# EAGLE design power_supply (EAGLE 9.6.2)
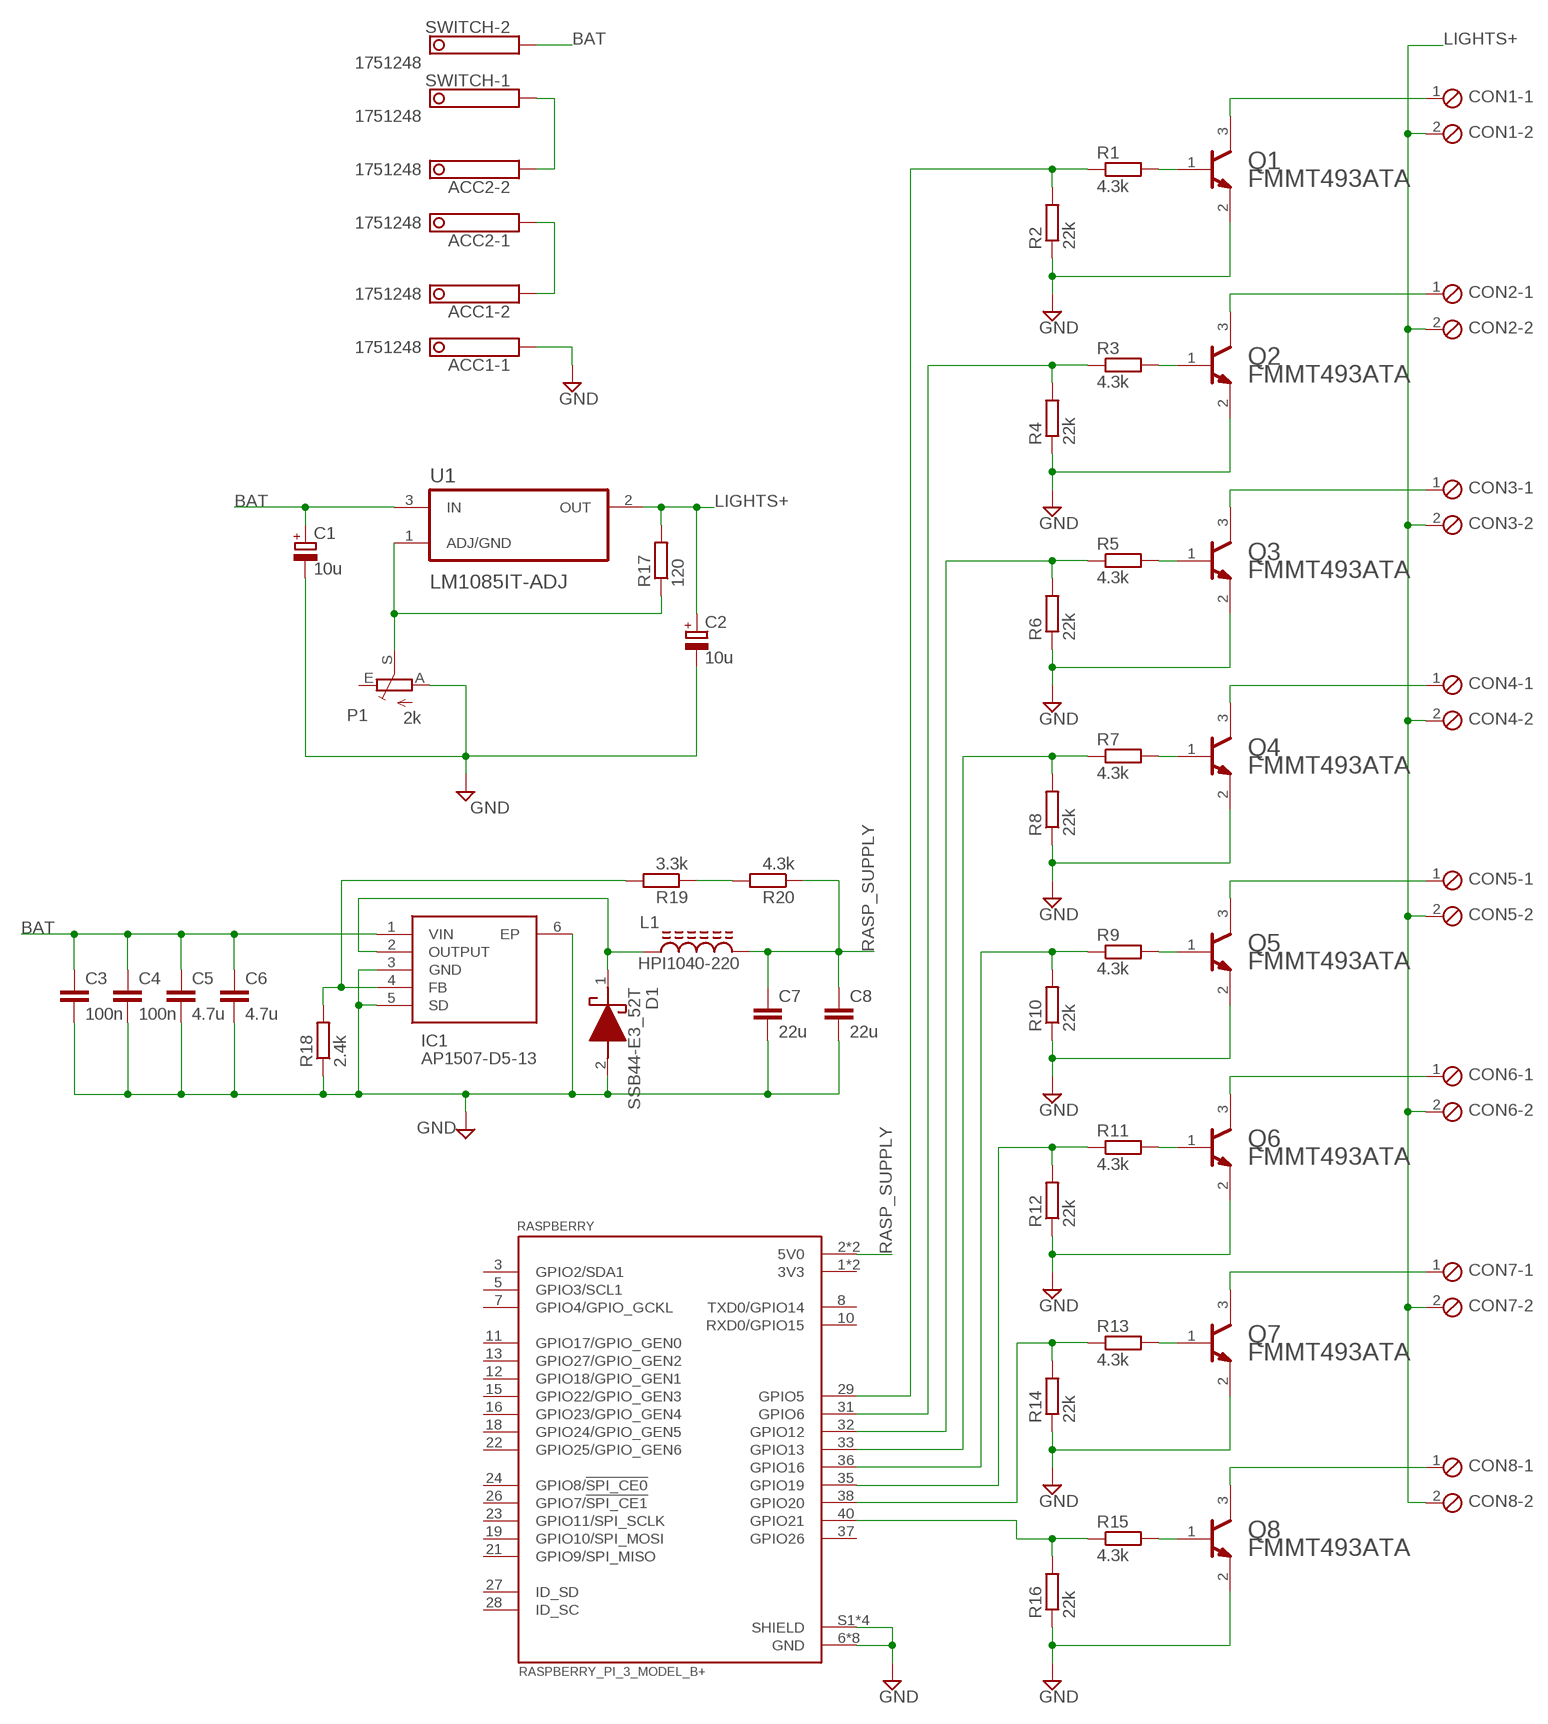
[diagram p0: schematic, sheet 1]

## Parts
ACC1  1751248  [1751248]
ACC2  1751248  [1751248]
C1  10u  CPOL-EUB/3528-21R  [B/3528-21R]
C2  10u  CPOL-EUB/3528-21R  [B/3528-21R]
C3  100n  C-EUC0603  [C0603]
C4  100n  C-EUC0603  [C0603]
C5  4.7u  C-EUC1206  [C1206]
C6  4.7u  C-EUC1206  [C1206]
C7  22u  C-EUC1206  [C1206]
C8  22u  C-EUC1206  [C1206]
CON1  +  MPT2  [2POL254]
CON2  +  MPT2  [2POL254]
CON3  +  MPT2  [2POL254]
CON4  +  MPT2  [2POL254]
CON5  +  MPT2  [2POL254]
CON6  +  MPT2  [2POL254]
CON7  +  MPT2  [2POL254]
CON8  +  MPT2  [2POL254]
D1  SSB44-E3_52T  [DIOM5436X244N]
IC1  AP1507-D5-13  [AP1507D513]
L1  HPI1040-220  SRR1050A-151Y  [INDM102100X510N]
P1  2k  TRIM_EU-CA6V  [CA6V]
Q1  DIODES_FMMT493ATADIODES_FMMT493ATA_0_0  [DIODES_FMMT493ATA_0]
Q2  DIODES_FMMT493ATADIODES_FMMT493ATA_0_0  [DIODES_FMMT493ATA_0]
Q3  DIODES_FMMT493ATADIODES_FMMT493ATA_0_0  [DIODES_FMMT493ATA_0]
Q4  DIODES_FMMT493ATADIODES_FMMT493ATA_0_0  [DIODES_FMMT493ATA_0]
Q5  DIODES_FMMT493ATADIODES_FMMT493ATA_0_0  [DIODES_FMMT493ATA_0]
Q6  DIODES_FMMT493ATADIODES_FMMT493ATA_0_0  [DIODES_FMMT493ATA_0]
Q7  DIODES_FMMT493ATADIODES_FMMT493ATA_0_0  [DIODES_FMMT493ATA_0]
Q8  DIODES_FMMT493ATADIODES_FMMT493ATA_0_0  [DIODES_FMMT493ATA_0]
R1  4.3k  R-EU_R0805  [R0805]
R2  22k  R-EU_R0805  [R0805]
R3  4.3k  R-EU_R0805  [R0805]
R4  22k  R-EU_R0805  [R0805]
R5  4.3k  R-EU_R0805  [R0805]
R6  22k  R-EU_R0805  [R0805]
R7  4.3k  R-EU_R0805  [R0805]
R8  22k  R-EU_R0805  [R0805]
R9  4.3k  R-EU_R0805  [R0805]
R10  22k  R-EU_R0805  [R0805]
R11  4.3k  R-EU_R0805  [R0805]
R12  22k  R-EU_R0805  [R0805]
R13  4.3k  R-EU_R0805  [R0805]
R14  22k  R-EU_R0805  [R0805]
R15  4.3k  R-EU_R0805  [R0805]
R16  22k  R-EU_R0805  [R0805]
R17  120  R-EU_R0805  [R0805]
R18  2.4k  R-EU_R0805  [R0805]
R19  3.3k  R-EU_R0805  [R0805]
R20  4.3k  R-EU_R0805  [R0805]
RASPBERRY  RASPBERRY_PI_3_MODEL_B+  [MODULE_RASPBERRY_PI_3_MODEL_B+]
SWITCH  1751248  [1751248]
U1  LM1085IT-ADJ  [TO254P1054X470X1955-3]

## Nets
BAT: C1.+ C3.1 C4.1 C5.1 C6.1 IC1.1(VIN) SWITCH.2 U1.3(IN)
GND: ACC1.1 C1.- C2.- C3.2 C4.2 C5.2 C6.2 C7.2 C8.2 D1.2(A) IC1.3(GND) IC1.5(SD) IC1.6(EP) P1.A Q1.2(E) Q2.2(E) Q3.2(E) Q4.2(E) Q5.2(E) Q6.2(E) Q7.2(E) Q8.2(E) R2.1 R4.1 R6.1 R8.1 R10.1 R12.1 R14.1 R16.1 R18.1 RASPBERRY.6(GND) RASPBERRY.9(GND) RASPBERRY.14(GND) RASPBERRY.20(GND) RASPBERRY.25(GND) RASPBERRY.30(GND) RASPBERRY.34(GND) RASPBERRY.39(GND) RASPBERRY.S1(SHIELD) RASPBERRY.S2(SHIELD) RASPBERRY.S3(SHIELD) RASPBERRY.S4(SHIELD)
LIGHTS+: C2.+ CON1.2 CON2.2 CON3.2 CON4.2 CON5.2 CON6.2 CON7.2 CON8.2 R17.2 U1.2(OUT)
N$1: CON1.1 Q1.3(C)
N$2: R19.1 R20.2
N$3: ACC1.2 ACC2.1
N$4: IC1.4(FB) R18.2 R19.2
N$5: Q2.1(B) R3.2
N$6: CON2.1 Q2.3(C)
N$7: ACC2.2 SWITCH.1
N$9: Q3.1(B) R5.2
N$10: CON3.1 Q3.3(C)
N$13: Q4.1(B) R7.2
N$14: CON4.1 Q4.3(C)
N$17: Q5.1(B) R9.2
N$18: CON5.1 Q5.3(C)
N$19: R1.1 R2.2 RASPBERRY.29(GPIO5)
N$20: R3.1 R4.2 RASPBERRY.31(GPIO6)
N$21: R5.1 R6.2 RASPBERRY.32(GPIO12)
N$22: Q1.1(B) R1.2
N$23: R7.1 R8.2 RASPBERRY.33(GPIO13)
N$24: R9.1 R10.2 RASPBERRY.36(GPIO16)
N$25: R11.1 R12.2 RASPBERRY.35(GPIO19)
N$26: R13.1 R14.2 RASPBERRY.38(GPIO20)
N$27: R15.1 R16.2 RASPBERRY.40(GPIO21)
N$29: P1.S R17.1 U1.1(ADJ/GND)
N$32: D1.1(K) IC1.2(OUTPUT) L1.1
N$33: Q6.1(B) R11.2
N$34: CON6.1 Q6.3(C)
N$37: Q7.1(B) R13.2
N$38: CON7.1 Q7.3(C)
N$41: Q8.1(B) R15.2
N$42: CON8.1 Q8.3(C)
RASP_SUPPLY: C7.1 C8.1 L1.2 R20.1 RASPBERRY.2(5V0) RASPBERRY.4(5V0)
Unconnected: P1.E RASPBERRY.3(GPIO2/SDA1) RASPBERRY.5(GPIO3/SCL1) RASPBERRY.7(GPIO4/GPIO_GCKL) RASPBERRY.8(TXD0/GPIO14) RASPBERRY.10(RXD0/GPIO15) RASPBERRY.11(GPIO17/GPIO_GEN0) RASPBERRY.12(GPIO18/GPIO_GEN1) RASPBERRY.13(GPIO27/GPIO_GEN2) RASPBERRY.15(GPIO22/GPIO_GEN3) RASPBERRY.16(GPIO23/GPIO_GEN4) RASPBERRY.18(GPIO24/GPIO_GEN5) RASPBERRY.19(GPIO10/SPI_MOSI) RASPBERRY.21(GPIO9/SPI_MISO) RASPBERRY.22(GPIO25/GPIO_GEN6) RASPBERRY.23(GPIO11/SPI_SCLK) RASPBERRY.24(GPIO8/!SPI_CE0!) RASPBERRY.26(GPIO7/!SPI_CE1!) RASPBERRY.27(ID_SD) RASPBERRY.28(ID_SC) RASPBERRY.37(GPIO26)

## Power pins joined to a net without a drawn wire
3V3: RASPBERRY.1(3V3) RASPBERRY.17(3V3)

## Library data of the parts
ACC1 ACC2 SWITCH = con-phoenix-350:1751248: MKDS 1/ 2-3,5 Printklemme Nennstrom: 10 A Bemessungsspannung: 160 V Raster: 3,5 mm Polzahl: 2 Montageart: Löten Anschlussart: Schraubanschluss Anschlussrichtung vom Leiter zur Platine: 0° Source: http://eshop.phoenixcontact.com .. 1751248.pdf; OC_FARNELL: unknown; OC_NEWARK: unknown
C1 C2 = rcl:CPOL-EU: POLARIZED CAPACITOR, European symbol; SPICEPREFIX: C
C3-C8 = rcl:C-EU: CAPACITOR, European symbol; SPICEPREFIX: C
CON1-CON8 = con-phoenix-254:MPT2: PHOENIX CONNECTOR; OC_FARNELL: unknown; OC_NEWARK: unknown
D1 = SSB44-E3_52T:SSB44-E3_52T: Vishay 40V 4A, Schottky Diode, 2-Pin DO-214AA SSB44-E3/52T Source: Datasheet <https://www.vishay.com/docs/88884/ssb43l.pdf>; ARROW_PART_NUMBER: SSB44-E3/52T; ARROW_PRICE-STOCK: https://www.arrow.com/en/products/ssb44-e352t/vishay?region=europe; DESCRIPTION: Vishay 40V 4A, Schottky Diode, 2-Pin DO-214AA SSB44-E3/52T; HEIGHT: 2.44mm; MANUFACTURER_NAME: Vishay; MANUFACTURER_PART_NUMBER: SSB44-E3/52T; MOUSER_PART_NUMBER: 625-SSB44-E3; MOUSER_PRICE-STOCK: https://www.mouser.co.uk/ProductDetail/Vishay-General-Semiconductor/SSB44-E3-52T?qs=x2jpVgRnAtOp%252BgpElPB95w%3D%3D
IC1 = AP1507-D5-13:AP1507-D5-13: Switching Voltage Regulators DCDC Conv HV Buck Source: Datasheet <https://componentsearchengine.com/Datasheets/1/AP1507-D5-13.pdf>; DESCRIPTION: Switching Voltage Regulators DCDC Conv HV Buck; HEIGHT: 2mm; MANUFACTURER_NAME: Diodes Inc.; MANUFACTURER_PART_NUMBER: AP1507-D5-13; MOUSER_PART_NUMBER: 621-AP1507-D5-13; MOUSER_PRICE-STOCK: https://www.mouser.com/Search/Refine.aspx?Keyword=621-AP1507-D5-13
L1 = SRR1050A-151Y:SRR1050A-151Y: Inductor Power Shielded Wirewound 12uH 30% 100KHz Ferrite 3.8A 35mOhm DCR Automotive T/R Check availability <https://pricing.snapeda.com/parts/SRR1050A-151Y/Bourns/view-part?ref=eda>; AVAILABILITY: In Stock; DESCRIPTION: Inductor Power Shielded Wirewound 150uH 30% 100KHz Ferrite 1.1A 370mOhm DCR Automotive T/R; MF: Bourns; MP: SRR1050A-151Y; PACKAGE: Nonstandard Bourns; PRICE: None; PURCHASE-URL: https://pricing.snapeda.com/search/part/SRR1050A-151Y/?ref=eda
P1 = pot:TRIM_EU-: POTENTIOMETER
Q1-Q8 = Diodes - FMMT493ATA:DIODES_FMMT493ATA: TRANS NPN 60V 1A SOT23-3; CENTROID_NOT_SPECIFIED: No; COLLECTOR_BASE_VOLTAGE: 120V; COLLECTOR_EMITTER_BREAKDOWN_VOLTAGE: 60V; COLLECTOR_EMITTER_SATURATION_VOLTAGE: 500mV; COLLECTOR_EMITTER_VOLTAGE: 60V; DATASHEET: https://www.diodes.com/assets/Datasheets/FMMT493A.pdf; DEVICE_CLASS_L1: Discrete Semiconductors; DEVICE_CLASS_L2: Transistors; DEVICE_CLASS_L3: BJTs; DIGIKEY_DESCRIPTION: TRANS NPN 60V 1A SOT23-3; DIGIKEY_PART_NUMBER: FMMT493ACT-ND; EMITTER_BASE_VOLTAGE: 7V; FOOTPRINT_URL: https://www.diodes.com/assets/Package-Files/SOT23-Type-DN.pdf; HEIGHT: 1.12mm; HFE_MIN: 20; LEAD_FREE: yes; MAX_COLLECTOR_CURRENT: 1A; MAX_JUNCTION_TEMP: +150°C; MF: Diodes; MFG_PACKAGE_IDENT: SOT23 (Type DN); MFG_PACKAGE_IDENT_DATE: 12/2016; MFG_PACKAGE_IDENT_REV: 0; MOUSER_DESCRIPTION: Bipolar Transistors - BJT NPN Medium Power; MOUSER_PART_NUMBER: 522-FMMT493ATA; MPN: FMMT493ATA; NUMBER_OF_ELEMENTS: 1; NUMBER_OF_NPN: 1; PACKAGE: SOT23 (Type DN); POWER_DISSIPATION: 500mW; PREFIX: Q; ROHS: yes; STANDOFF_HEIGHT: 0.01mm; TEMPERATURE_RANGE_HIGH: +150°C; TEMPERATURE_RANGE_LOW: -55°C; VERIFICATION_VERSION: 0.0.0.1
R1-R20 = rcl:R-EU_: RESISTOR, European symbol; SPICEPREFIX: R
RASPBERRY = RASPBERRY_PI_3_MODEL_B_NoScrew:RASPBERRY_PI_3_MODEL_B+: BCM2835 Raspberry Pi Model B+ - ARM11, VideoCore MPU Embedded Evaluation Board Check availability <https://pricing.snapeda.com/parts/RASPBERRY%20PI%203%20MODEL%20B%2B/Raspberry%20Pi/view-part?ref=eda>; AVAILABILITY: In Stock; DESCRIPTION: RASPBERRY PI 3 MOD B+ BCM2837B0; MF: Raspberry Pi; MP: RASPBERRY PI 3 MODEL B+; PACKAGE: None; PRICE: None; PURCHASE-URL: https://pricing.snapeda.com/search/part/RASPBERRY PI 3 MODEL B+/?ref=eda
U1 = LM1085IT-ADJ:LM1085IT-ADJ: Check availability <https://pricing.snapeda.com/parts/LM1085IT-ADJ/NOPB/Texas%20Instruments/view-part?ref=eda>; AVAILABILITY: In Stock; DESCRIPTION: 3-A, 29-V, linear voltage regulator; MF: Texas Instruments; MP: LM1085IT-ADJ/NOPB; PACKAGE: TO-220-3 Texas Instruments; PRICE: None; PURCHASE-URL: https://pricing.snapeda.com/search/part/LM1085IT-ADJ/NOPB/?ref=eda

## Board
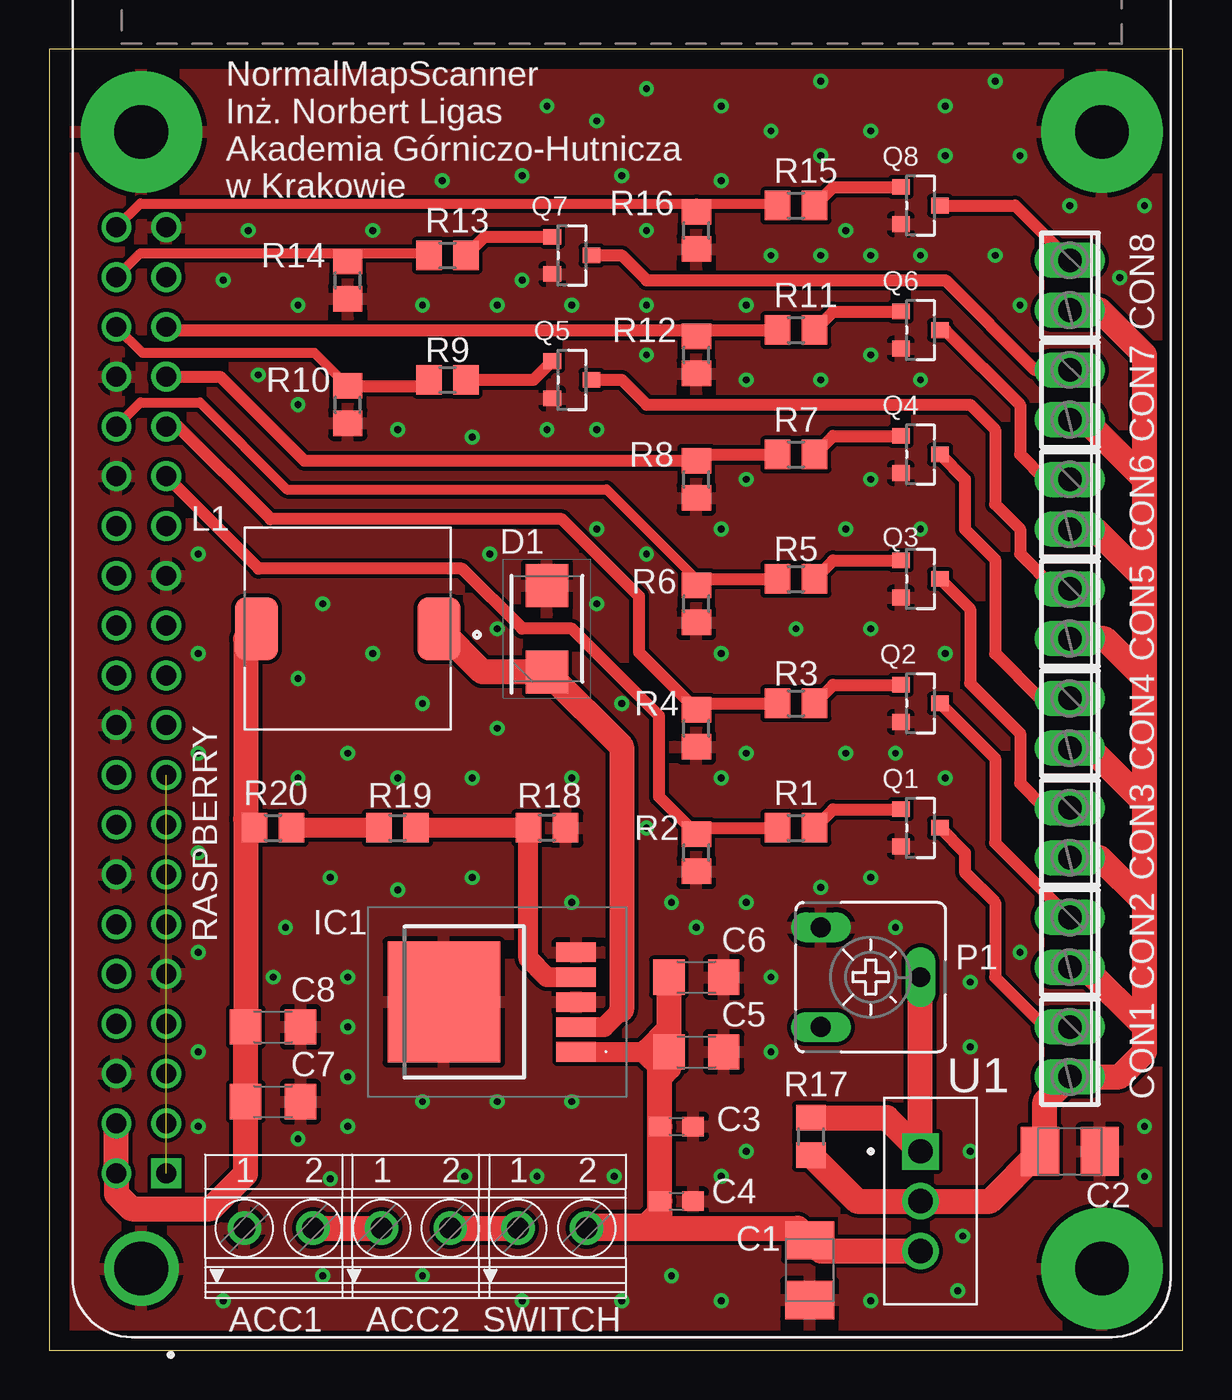
[diagram p1: board, top side]
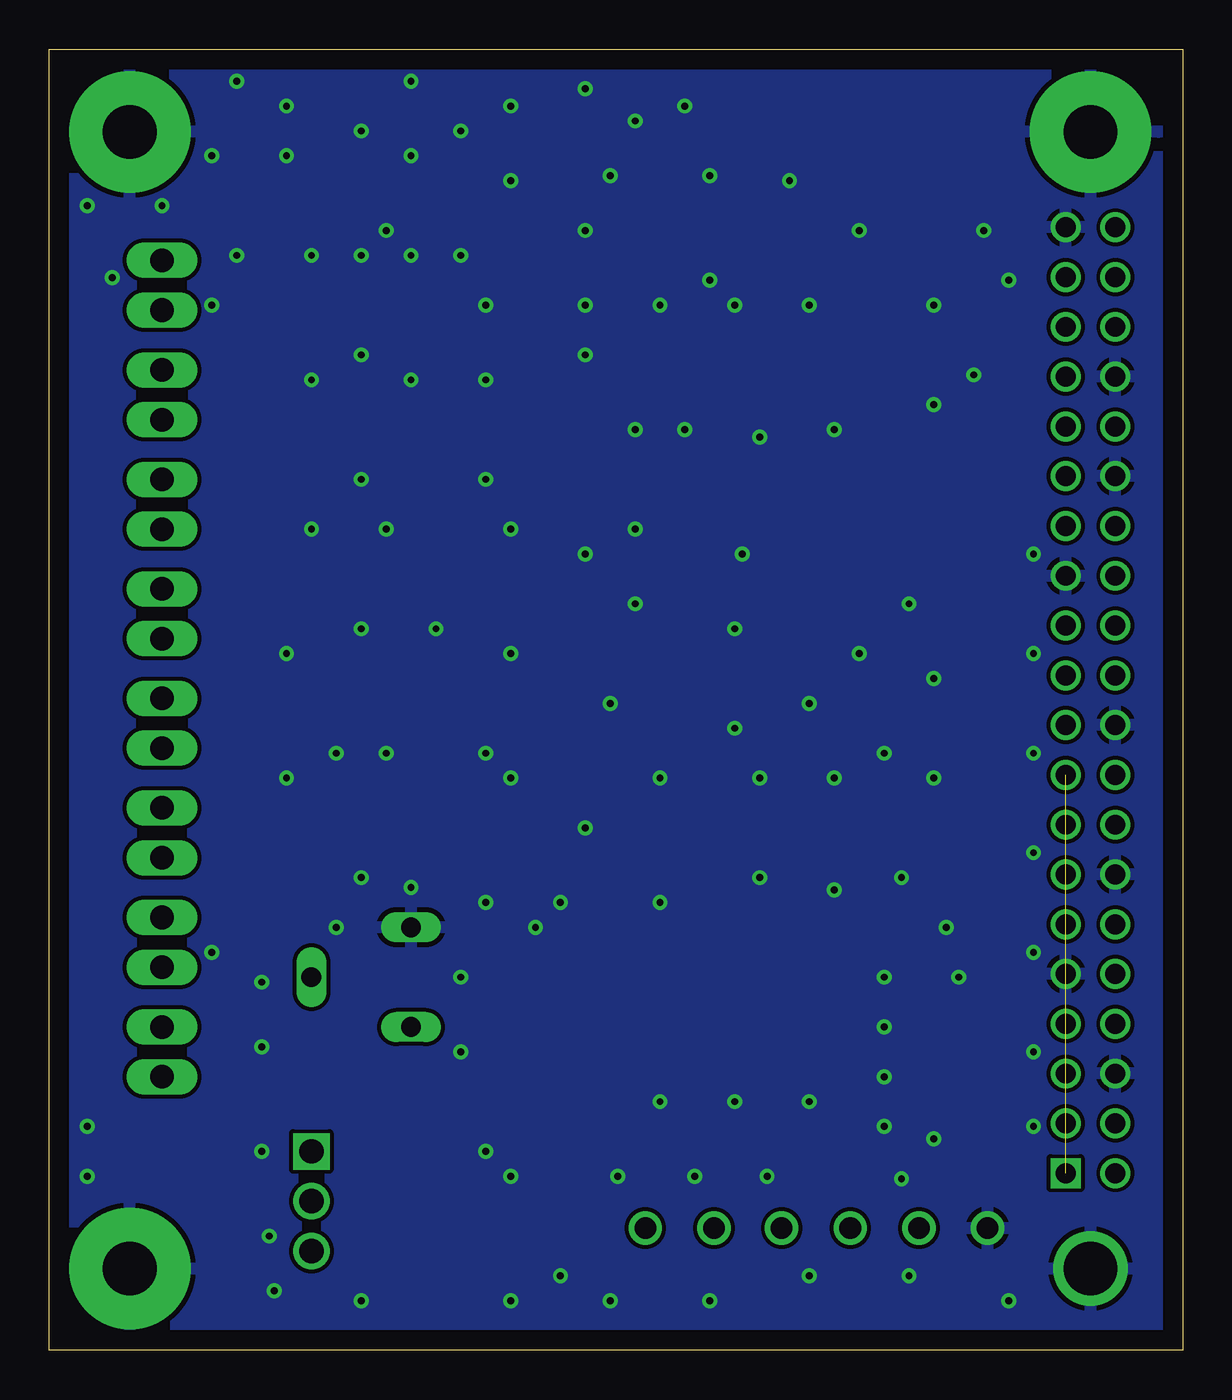
[diagram p2: board, bottom side, seen from below]

Size 57.84 x 66.41 mm. Coordinates in mm from the lower left corner, seen from the top.
Outline: 0,0 57.84,0 57.84,66.41 0,66.41 0,0
Copper layers (1*16): Top 0.035mm / dielectric 1.5mm / Bottom 0.035mm
Design rules "NormalMapScanner *": minimum track width 8mil, minimum drill 0.35mm, track to track 8mil, track to pad 8mil, pad to pad 8mil, via to via 8mil, smd to smd 8mil, copper to edge 40mil, drill to drill 8mil, minimum pad ring 10mil, minimum via ring 8mil, stop-mask expansion 4mil, vias tented up to drill 0mil, thermal gap 10mil

### Footprints (pad centres in the part's own frame; a part is rotated, then mirrored left to right if it is on the bottom)
1751248 = drill 1.1 pad 1.7: 1 -1.75,-0.1; 2 1.75,-0.1
B/3528-21R = smd 1.95 x 2.5: + 1.525,0; - -1.525,0
C0603 = smd 1.1 x 1: 1 -0.85,0; 2 0.85,0
C1206 = smd 1.6 x 1.8: 1 -1.4,0; 2 1.4,0
2POL254 = drill 1.2 long: 1 -1.27,0; 2 1.27,0
DIOM5436X244N = smd 2.2 x 2.15: 1 -2.2,0; 2 2.2,0
AP1507D513 = smd 1 x 2: 1 -2.54,-4.025; 2 -1.27,-4.025; 3 0,-4.025; 4 1.27,-4.025; 5 2.54,-4.025 | smd 6.17 x 5.73: 6 0,2.72
INDM102100X510N = smd 2.19 x 3.21: 1 -4.66,0; 2 4.66,0
CA6V = drill 1.016 long: A -2.54,-2.54; E 2.54,-2.54; S 0,2.54
DIODES_FMMT493ATA_0 = smd 0.8 x 0.9: 1 -0.95,-1; 2 0.95,-1; 3 0,1
R0805 = smd 1.3 x 1.5: 1 -0.95,0; 2 0.95,0
MODULE_RASPBERRY_PI_3_MODEL_B+ = drill 1.016 square: 1 -34.13,23.23 | drill 1.016: 2 -34.13,25.77; 3 -31.59,23.23; 4 -31.59,25.77; 5 -29.05,23.23; 6 -29.05,25.77; 7 -26.51,23.23; 8 -26.51,25.77; 9 -23.97,23.23; 10 -23.97,25.77; 11 -21.43,23.23; 12 -21.43,25.77; 13 -18.89,23.23; 14 -18.89,25.77; 15 -16.35,23.23; 16 -16.35,25.77; 17 -13.81,23.23; 18 -13.81,25.77; 19 -11.27,23.23; 20 -11.27,25.77; 21 -8.73,23.23; 22 -8.73,25.77; 23 -6.19,23.23; 24 -6.19,25.77; 25 -3.65,23.23; 26 -3.65,25.77; 27 -1.11,23.23; 28 -1.11,25.77; 29 1.43,23.23; 30 1.43,25.77; 31 3.97,23.23; 32 3.97,25.77; 33 6.51,23.23; 34 6.51,25.77; 35 9.05,23.23; 36 9.05,25.77; 37 11.59,23.23; 38 11.59,25.77; 39 14.13,23.23; 40 14.13,25.77 | drill 2.75 pad 3.81: S1 -39,24.5 | drill 2.75 pad 6.2: S2 19,24.5; S3 19,-24.5; S4 -39,-24.5
TO254P1054X470X1955-3 = drill 1.24 square: 1 -2.54,0 | drill 1.24: 2 0,0; 3 2.54,0

### Placement (x,y rotation side)
ACC1  11.72,6.34 0 top
ACC2  18.72,6.34 0 top
C1  38.8,4.1 90 top
C2  52.07,10.16 180 top
C3  32,11.43 0 top
C4  32,7.62 0 top
C5  33.02,15.24 0 top
C6  33.02,19.05 0 top
C7  11.43,12.7 0 top
C8  11.43,16.51 0 top
CON1  52.07,15.24 270 top
CON2  52.07,20.83 270 top
CON3  52.07,26.42 270 top
CON4  52.07,32 270 top
CON5  52.07,37.59 270 top
CON6  52.07,43.18 270 top
CON7  52.07,48.77 270 top
CON8  52.07,54.36 270 top
D1  25.4,36.83 90 top
IC1  22.86,17.78 90 top
L1  15.24,36.83 180 top
P1  41.91,19.05 270 top
Q1  44.45,26.67 270 top
Q2  44.45,33.02 270 top
Q3  44.45,39.37 270 top
Q4  44.45,45.72 270 top
Q5  26.67,49.53 270 top
Q6  44.45,52.07 270 top
Q7  26.67,55.88 270 top
Q8  44.45,58.42 270 top
R1  38.1,26.67 0 top
R2  33.02,25.4 90 top
R3  38.1,33.02 0 top
R4  33.02,31.75 90 top
R5  38.1,39.37 0 top
R6  33.02,38.1 90 top
R7  38.1,45.72 0 top
R8  33.02,44.45 90 top
R9  20.32,49.53 0 top
R10  15.24,48.26 90 top
R11  38.1,52.07 0 top
R12  33.02,50.8 90 top
R13  20.32,55.88 0 top
R14  15.24,54.61 90 top
R15  38.1,58.42 0 top
R16  33.02,57.15 90 top
R17  38.86,10.92 270 top
R18  25.4,26.67 180 top
R19  17.78,26.67 0 top
R20  11.43,26.67 0 top
RASPBERRY  29.21,43.18 90 top
SWITCH  25.67,6.34 0 top
U1  44.45,7.62 270 top

### Tracks (layer width: path | path; a pad name or v marks a point on that pad's centre or on a via)
3V3  (1 unrouted)
BAT
  Top 1.016: IC1.1 30.48,15.24 30.5,15.22
  Top 1.27: 31.15,13.97 31.15,14.57 30.5,15.22 | C5.1 30.48,15.24 31.62,16.38 C6.1 31.62,14.44 31.15,13.97 | U1.3 39.37,5.08 38.82,5.63 C1.+ 38.18,6.24 SWITCH.2 27.53,6.35 30.48,6.35 31.15,7.02 C4.1 C3.1 31.15,13.97
GND  (via drill 0.35)
  other vias: 7.62,25.4 12.7,29.21 7.62,30.48 20.07,59.69 25.4,63.5 30.48,64.39 27.94,62.74 24.13,59.94 29.21,59.94 34.29,63.5 34.29,59.69 36.83,62.23 39.37,60.96 39.37,64.77 41.91,62.23 45.72,63.5 48.26,64.77 45.72,60.96 49.53,60.96 52.07,58.42 55.88,58.42 54.61,54.74 48.26,55.88 49.53,53.34 44.45,49.53 41.91,50.8 44.45,55.88 41.91,55.88 40.64,57.15 39.37,55.88 36.83,55.88 35.56,53.34 35.56,49.53 39.37,49.53 35.56,44.45 41.91,44.45 40.64,41.91 44.45,41.91 34.29,41.91 34.29,35.56 38.1,36.83 41.91,36.83 45.72,35.56 45.72,29.21 43.18,30.48 40.64,30.48 35.56,30.48 34.29,29.21 35.56,22.86 39.37,23.62 41.91,24.13 43.18,21.59 46.99,18.8 46.99,15.49 46.99,10.16 55.88,11.43 55.88,8.89 46.61,5.84 46.35,3.05 41.91,2.54 34.29,2.54 31.75,3.81 29.21,2.54 24.13,2.54 19.05,3.81 13.97,3.81 8.89,2.54 12.7,10.79 7.62,11.43 15.24,11.43 7.62,15.24 15.24,13.97 19.05,12.7 14.35,8.76 21.21,8.89 22.86,12.7 24.89,8.89 26.67,12.7 28.83,8.89 34.29,8.89 35.56,10.16 36.83,15.24 36.83,19.05 33.02,21.59 31.75,22.86 49.53,20.32 10.16,57.15 16.51,57.15 30.48,57.15 30.48,53.34 26.67,53.34 24.13,54.61 22.86,53.34 19.05,53.34 12.7,53.34 8.89,54.61 10.67,49.78 12.7,48.26 17.78,46.99 21.59,46.61 25.4,46.99 27.94,46.99 30.48,50.8 7.62,40.64 7.62,35.56 13.97,38.1 12.7,34.29 16.51,35.56 19.05,33.02 15.24,30.48 22.48,40.64 27.94,41.91 30.48,40.64 22.86,31.75 17.78,29.21 21.59,29.21 26.67,29.21 26.67,22.86 17.78,23.5 21.59,24.13 14.35,24.13 12.06,21.59 11.43,19.05 15.24,19.05 15.24,16.51 7.62,20.32 22.86,36.83 29.21,33.02 30.48,26.67 27.94,38.1
  pour Top: -2.54,67.31 -2.54,-2.54 60.96,-2.54 60.96,69.85 -2.54,69.85
  pour Bottom: -3.81,69.85 -3.81,-2.54 60.96,-2.54 60.96,69.85
LIGHTS+
  Top 1.27: R17.2 41.21,7.62 U1.2 48.01,7.62 C2.+ 50.8,10.42 50.8,12.7 CON1.2 54.61,13.97 55.88,15.24 55.88,16.51 | 55.88,16.51 52.83,19.56 CON2.2 | 55.88,16.51 55.88,22.86 | 55.88,22.86 53.59,25.15 CON3.2 | 55.88,22.86 55.88,27.94 | 55.88,27.94 53.09,30.73 CON4.2 | 55.88,27.94 55.88,34.29 | 55.88,34.29 53.85,36.32 CON5.2 | 55.88,34.29 55.88,39.37 | 55.88,39.37 55.88,44.45 | 55.88,44.45 52.83,47.5 CON7.2 | 55.88,44.45 55.88,50.8 53.59,53.09 CON8.2 | CON6.2 53.34,41.91 55.88,39.37
N$1
  Top 0.61: CON1.1 50.8,16.51 48.26,19.05 48.26,22.86 46.72,24.4 46.72,25.4 Q1.3
N$2
  Top 1.016: R19.1 R20.2
N$3
  Top 1.27: ACC1.2 ACC2.1
N$4
  Top 1.016: IC1.4 25.4,19.05 24.45,20 R18.2 R19.2
N$5
  Top 0.61: R3.2 40,33.97 Q2.1
N$6
  Top 0.61: Q2.3 48.26,30.21 48.26,25.91 CON2.1
N$7
  Top 1.27: ACC2.2 SWITCH.1
N$9
  Top 0.61: R5.2 40,40.32 Q3.1
N$10
  Top 0.61: Q3.3 46.99,37.83 46.99,34.04 49.53,31.5 49.53,28.96 50.8,27.69 CON3.1
N$13
  Top 0.61: R7.2 40,46.67 Q4.1
N$14
  Top 0.61: Q4.3 46.72,44.45 46.72,41.91 48.26,40.37 48.26,35.56 50.55,33.27 CON4.1
N$17
  Top 0.61: R9.2 24.72,49.53 Q5.1
N$18
  Top 0.61: Q5.3 29.21,49.53 30.48,48.26 46.99,48.26 48.26,46.99 48.26,43.18 49.53,41.91 49.53,40.64 51.31,38.86 CON5.1
N$19
  Top 0.61: R1.1 33.34,26.67 R2.2 31.11,28.25 31.11,32.38 26.67,36.83 24.13,36.83 21.06,39.9 10.69,39.9 RASPBERRY.29
N$20
  Top 0.61: RASPBERRY.31 6.58,47.15 11.31,42.42 26.16,42.42 30.1,38.48 30.1,35.62 R4.2 33.34,33.02 R3.1
N$21
  Top 0.508: RASPBERRY.32 4.66,48.37 7.7,48.37 12.13,43.94 28.45,43.94 33.02,39.37
  Top 0.61: R5.1 33.34,39.37 R6.2 33.02,39.37
N$22
  Top 0.61: R1.2 40,27.62 Q1.1
N$23
  Top 0.61: RASPBERRY.33 8.73,49.69 13.02,45.4 R8.2 33.34,45.72 R7.1
N$24
  Top 0.508: RASPBERRY.36 4.76,50.91 13.54,50.91 R10.2
  Top 0.61: R10.2 19.05,49.21 R9.1
N$25
  Top 0.61: RASPBERRY.35 6.19,52.23 6.35,52.07 33.02,52.07 | 33.02,52.07 R11.1 | R12.2 33.02,52.07
N$26
  Top 0.508: RASPBERRY.38 4.66,55.99 15.24,55.99 | 15.24,55.99 19.26,55.99 | R14.2 15.24,55.99
  Top 0.61: 19.26,55.99 R13.1
N$27
  Top 0.508: RASPBERRY.40 4.66,58.53 33.02,58.53 | 33.02,58.53 37.04,58.53 R15.1 | R16.2 33.02,58.53
N$29
  Top 1.27: R17.1 42.74,11.87 U1.1 P1.S
N$32
  Top 1.016: IC1.2 28.32,16.51 29.21,17.4
  Top 1.27: L1.1 22.1,34.63 D1.1 29.21,30.82 29.21,17.4
N$33
  Top 0.61: R11.2 40,53.02 Q6.1
N$34
  Top 0.61: Q6.3 45.72,52.07 49.53,48.26 49.53,45.72 50.8,44.45 CON6.1
N$37
  Top 0.61: R13.2 22.22,56.83 Q7.1
N$38
  Top 0.61: Q7.3 29.21,55.88 30.48,54.61 45.72,54.61 50.29,50.04 CON7.1
N$41
  Top 0.61: R15.2 40,59.37 Q8.1
N$42
  Top 0.61: Q8.3 49.28,58.42 CON8.1
RASP_SUPPLY
  Top 1.27: 10.03,27.12 10.03,36.28 L1.2 | 10.03,27.12 C8.1 C7.1 10.03,9.01 8.26,7.24 4.19,7.24 3.44,7.99 RASPBERRY.2 RASPBERRY.4 | R20.1 10.03,27.12

### Text on the board
tNames: NormalMapScanner / Inż. Norbert Ligas / Akademia Górniczo-Hutnicza / w Krakowie